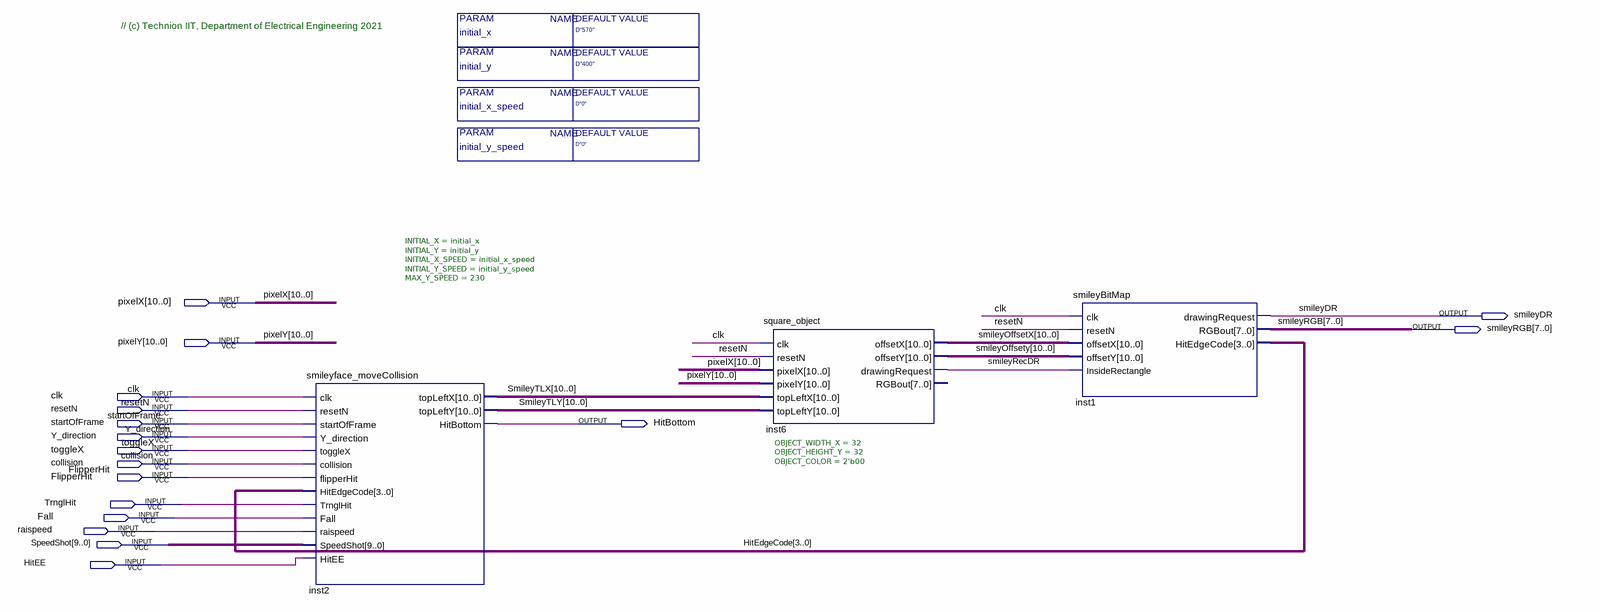
[diagram p0: schematic sheet]
// Quartus schematic Smiley_Block.bdf as structural Verilog: 3 symbols, 17 pins
module Smiley_Block #(parameter initial_x = "D\"570\"", parameter initial_y = "D\"400\"", parameter initial_x_speed = "D\"0\"", parameter initial_y_speed = "D\"0\"") (
  input  [10:0] pixelX,
  input  [10:0] pixelY,
  input  clk,
  input  resetN,
  input  startOfFrame,
  input  Y_direction,
  input  toggleX,
  input  collision,
  input  FlipperHit,
  input  TrnglHit,
  input  Fall,
  input  raispeed,
  input  [9:0] SpeedShot,
  input  HitEE,
  output smileyDR,
  output [7:0] smileyRGB,
  output HitBottom
);

  wire smileyRecDR;
  wire [3:0] HitEdgeCode;
  wire [10:0] smileyOffsetX, smileyOffsety, SmileyTLX, SmileyTLY;

  smileyface_moveCollision #(.INITIAL_X(initial_x), .INITIAL_Y(initial_y), .INITIAL_X_SPEED(initial_x_speed), .INITIAL_Y_SPEED(initial_y_speed), .MAX_Y_SPEED(230)) inst2 (
    .clk(clk), .resetN(resetN), .startOfFrame(startOfFrame), .Y_direction(Y_direction), .toggleX(toggleX),
    .collision(collision), .flipperHit(FlipperHit), .HitEdgeCode(HitEdgeCode), .TrnglHit(TrnglHit),
    .Fall(Fall), .raispeed(raispeed), .SpeedShot(SpeedShot), .HitEE(HitEE), .topLeftX(SmileyTLX),
    .topLeftY(SmileyTLY), .HitBottom(HitBottom));
  square_object #(.OBJECT_WIDTH_X(32), .OBJECT_HEIGHT_Y(32), .OBJECT_COLOR(2'b00)) inst6 (
    .clk(clk), .resetN(resetN), .pixelX(pixelX), .pixelY(pixelY), .topLeftX(SmileyTLX), .topLeftY(SmileyTLY),
    .offsetX(smileyOffsetX), .offsetY(smileyOffsety), .drawingRequest(smileyRecDR));  // open: RGBout
  smileyBitMap inst1 (
    .clk(clk), .resetN(resetN), .offsetX(smileyOffsetX), .offsetY(smileyOffsety),
    .InsideRectangle(smileyRecDR), .drawingRequest(smileyDR), .RGBout(smileyRGB), .HitEdgeCode(HitEdgeCode));

  // Notes on the sheet:
  //   // (c) Technion IIT, Department of Electrical Engineering 2021
endmodule
